# Altium schematic sheet EE464_SCH.SchDoc
size A3
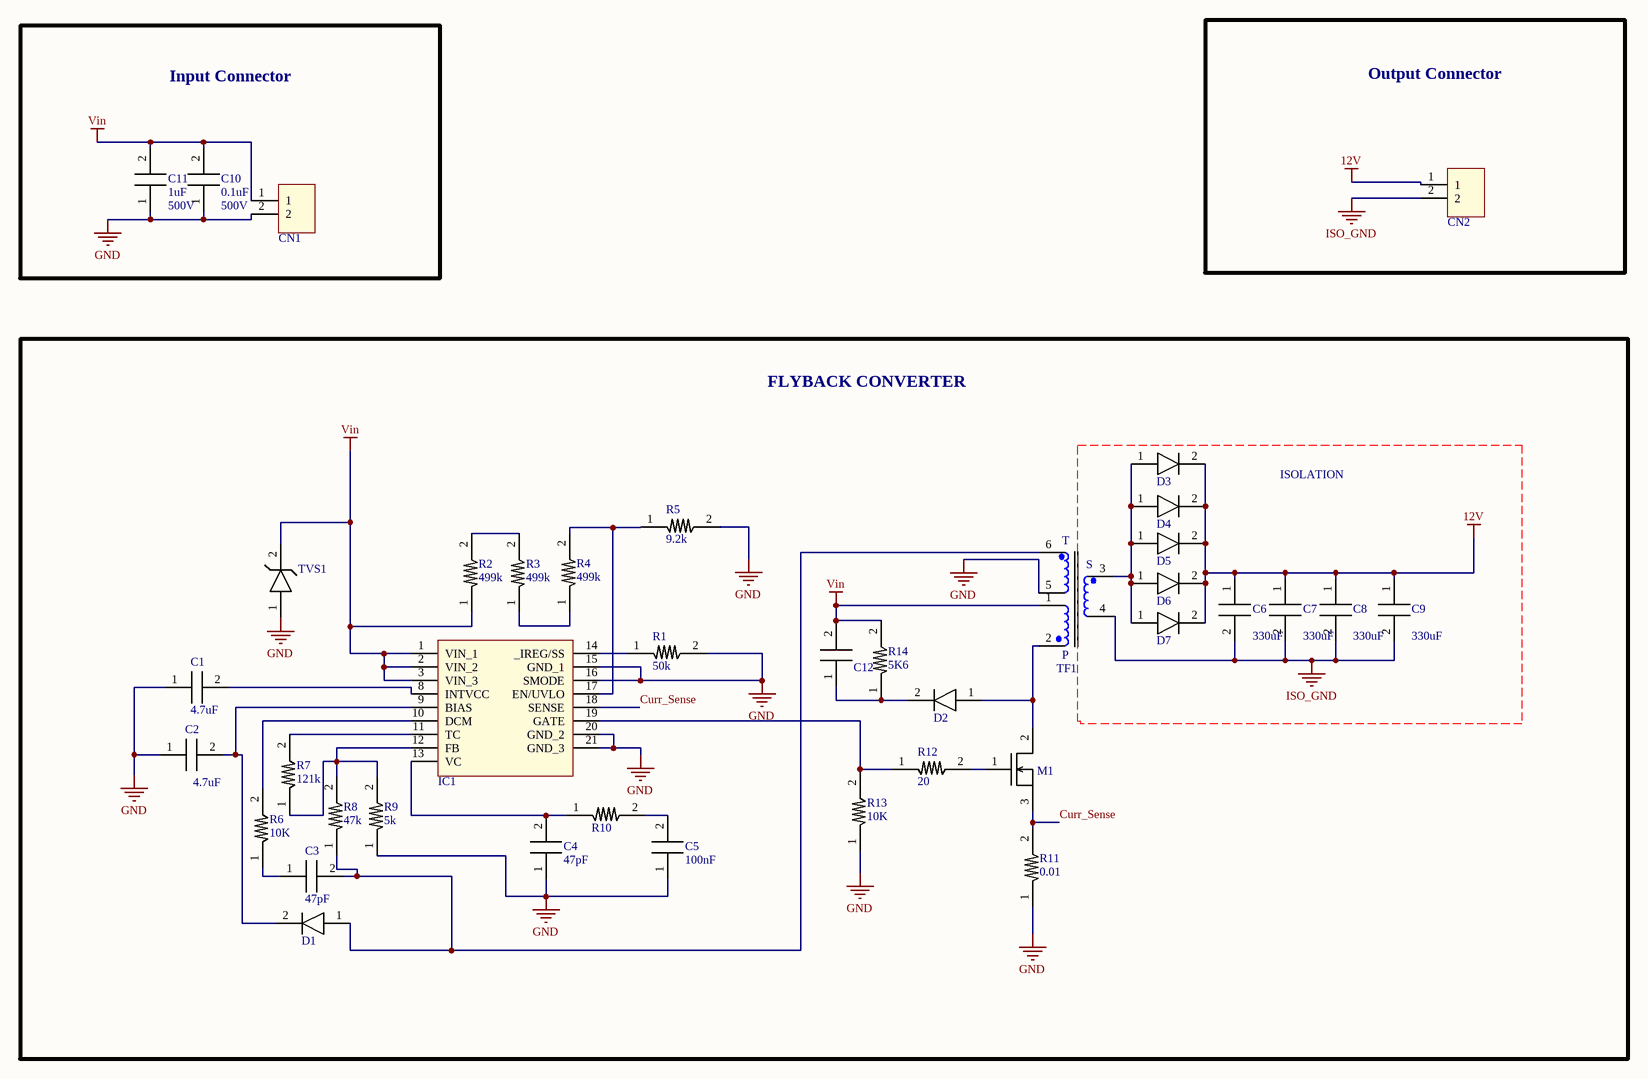
[diagram p0: EE464_SCH.SchDoc]

## Parts
C1  Parameter 1: 4.7uF  [CAP_1206]  (hidden comment: CAP 4.7uF 1206)
C2  Parameter 1: 4.7uF  [CAP_1206]  (hidden comment: CAP 4.7uF 1206)
C3  Parameter 1: 47pF  [0603_CAP]  (hidden comment: CAP 47pF 0603)
C4  Parameter 1: 47pF  [0603_CAP]  (hidden comment: CAP 47pF 0603)
C5  Parameter 1: 100nF  [0603_CAP]  (hidden comment: CAP 100nF)
C6  Parameter 1: 330uF  [CAPPRD350W65D800H900]  (hidden comment: A750KK337M1CAAE014)
C7  Parameter 1: 330uF  [CAPPRD350W65D800H900]  (hidden comment: A750KK337M1CAAE014)
C8  Parameter 1: 330uF  [CAPPRD350W65D800H900]  (hidden comment: A750KK337M1CAAE014)
C9  Parameter 1: 330uF  [CAPPRD350W65D800H900]  (hidden comment: A750KK337M1CAAE014)
C10  Parameter 1: 0.1uF  Parameter 2: 500V  [CAP_1210]  (hidden comment: CAP 0.1uF 500V 1210)
C11  Parameter 1: 1uF  Parameter 2: 500V  [CAP_2210]  (hidden comment: CAP 1uF 500v)
C12  CAP, 0.1u, 200V, 1206  [CAP_1206]  (value not drawn)
CN1  CONN_KLE_2_HV  [2828582]  (value not drawn)
CN2  CONN_KLE_2_LV  [691103110002]  (value not drawn)
D1  DI SK115  [DIOM5227X270N]  (value not drawn)
D2  DI S1J-E3/61T 600V 1A SMA  [DIOM5227X270N]  (value not drawn)
D3  DI CDBB3150-HF 150V 3A SMB  [S2GTR]  (value not drawn)
D4  DI CDBB3150-HF 150V 3A SMB  [S2GTR]  (value not drawn)
D5  DI CDBB3150-HF 150V 3A SMB  [S2GTR]  (value not drawn)
D6  DI CDBB3150-HF 150V 3A SMB  [S2GTR]  (value not drawn)
D7  DI CDBB3150-HF 150V 3A SMB  [S2GTR]  (value not drawn)
IC1  IC LT8316EFEPB  [LT8316IFEPBF]  (value not drawn)
M1  MOS, N-CH, IPD50R500CEAUMA1  [FDD5N50NZ]  (value not drawn)
R1  Parameter 1: 50k  [RES_1206]  (hidden comment: RES, 50K, 1206)
R2  Parameter 1: 499k  [RES_1206]  (hidden comment: RES, 499K, 1206)
R3  Parameter 1: 499k  [RES_1206]  (hidden comment: RES, 499K, 1206)
R4  Parameter 1: 499k  [RES_1206]  (hidden comment: RES, 499K, 1206)
R5  Parameter 1: 9.2k  [0603_RES]  (hidden comment: RES, 9.2K, 0603)
R6  Parameter 1: 10K  [0603_RES]  (hidden comment: RES, 10K, 0603)
R7  Parameter 1: 121k  [0603_RES]  (hidden comment: RES, 121K, 0603)
R8  Parameter 1: 47k  [0603_RES]  (hidden comment: RES, 47K, 0603)
R9  Parameter 1: 5k  [RES_0805]  (hidden comment: RES, 5K, 0805)
R10  RES, 15K, 0603  [0603_RES]  (value not drawn)
R11  Parameter 1: 0.01  [RES_1206]  (hidden comment: RES, 0.01,1206)
R12  Parameter 1: 20  [0603_RES]  (hidden comment: RES, 20, 0603)
R13  Parameter 1: 10K  [0603_RES]  (hidden comment: RES, 10K, 0603)
R14  Parameter 1: 5K6  [0603_RES]  (hidden comment: RES, 5K6, 0603)
TF1  TF 4:1  [tf_mount]  (value not drawn)
TVS1  TVS DI SMBJE400CA 400V SMB  [S2GTR]  (value not drawn)

## Blocks framed on the sheet
Input Connector: C10 C11 CN1
Output Connector: CN2
FLYBACK CONVERTER: C1-C9 C12 D1-D7 IC1 M1 R1-R14 TF1 TVS1

## Nets
12V: C6.1 C7.1 C8.1 C9.1 CN2.1 D3.2(Cathode) D4.2(Cathode) D5.2(Cathode) D6.2(Cathode) D7.2(Cathode)
GND: C1.1 C2.1 C4.1 C5.1 C10.1 C11.1 CN1.2 IC1.15(GND_1) IC1.16(SMODE) IC1.20(GND_2) IC1.21(GND_3) R1.2 R5.2 R9.1 R11.1 R13.1 TF1.5 TVS1.1(Anode)
ISO_GND: C6.2 C7.2 C8.2 C9.2 CN2.2 TF1.4
Vin: C10.2 C11.2 C12.2 CN1.1 IC1.1(VIN_1) IC1.2(VIN_2) IC1.3(VIN_3) R2.1 R14.2 TF1.1 TVS1.2(Cathode)
Curr_Sense: IC1.18(SENSE) M1.3 R11.2
NetC1_2: C1.2 IC1.8(INTVCC)
NetC2_2: C2.2 D1.2(Cathode) IC1.9(BIAS)
NetC3_1: C3.1 R6.1
NetC3_2: C3.2 D1.1(Anode) R8.1 TF1.6
NetC4_2: C4.2 IC1.13(VC) R10.1
NetC5_2: C5.2 R10.2
NetC12_1: C12.1 D2.2(Cathode) R14.1
NetD2_1: D2.1(Anode) M1.2 TF1.2
NetD3_1: D3.1(Anode) D4.1(Anode) D5.1(Anode) D6.1(Anode) D7.1(Anode) TF1.3
NetIC1_10: IC1.10(DCM) R6.2
NetIC1_11: IC1.11(TC) R7.2
NetIC1_12: IC1.12(FB) R7.1 R8.2 R9.2
NetIC1_14: IC1.14(_IREG/SS) R1.1
NetIC1_17: IC1.17(EN/UVLO) R4.2 R5.1
NetIC1_19: IC1.19(GATE) R12.1 R13.2
NetM1_1: M1.1 R12.2
NetR2_2: R2.2 R3.2
NetR3_1: R3.1 R4.1

## Notes on the sheet
- ISOLATION
- Title
- Size:
- Date:
- A3
- Number:
- Time:
- Revision:
- Sheet
- of
- File:

## Library data of the parts
C6-C9 = CAP 330uF AL. POLY.: CAP,330uF,AL.POLY.,16V, A750KK337M1CAAE014
D1 = DI SK115: DI, SK115, 150V, 1A, SMA
IC1 = IC LT8316EFEPB: IC, PMIC, Flyback Controller, 16-600V, 100W
TF1 = TF 4:1: Parameter 1: P; Parameter 2: S; Parameter 3: T